# Altium project HDMI_to_RGB.PrjPcb
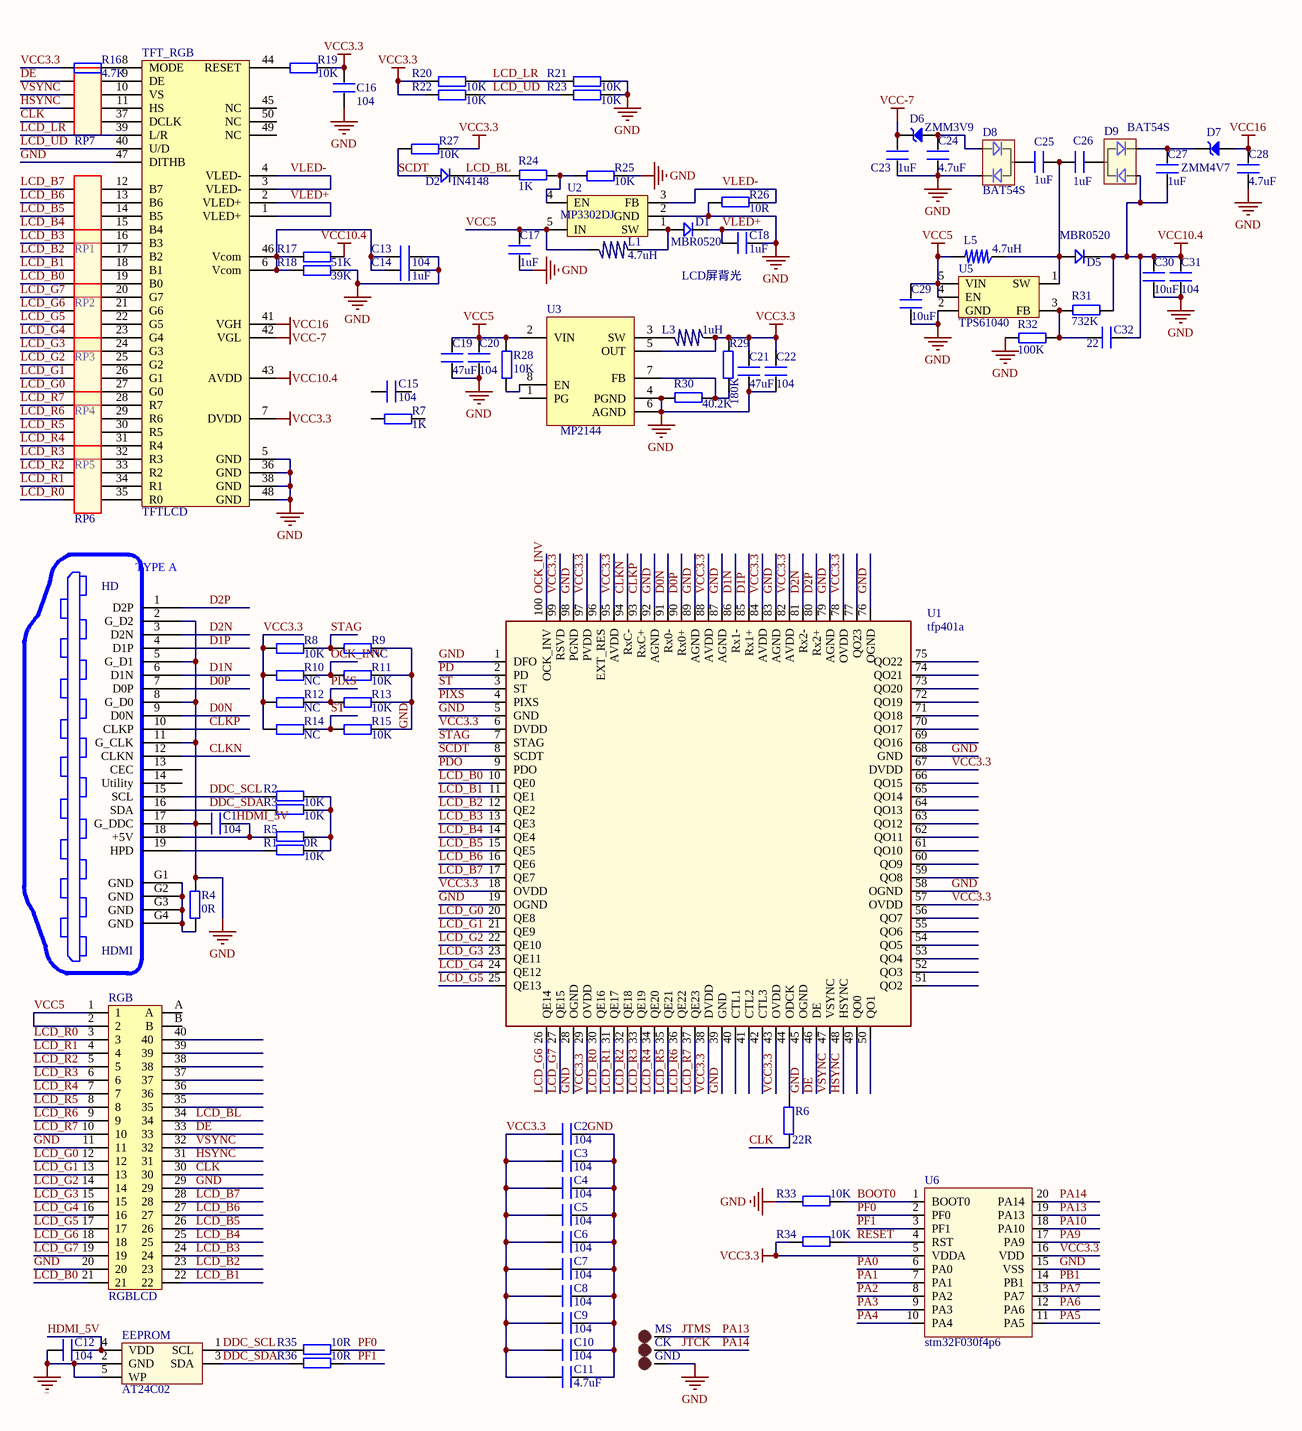
[diagram p0: HDMI_to_RGB.SchDoc]
1 sheet, 97 parts. Net scope: global (net labels, ports and power ports of the same name join across sheets).
Board file: HDMI_to_RGB.PcbDoc

## Sheet HDMI_to_RGB.SchDoc
size A3

### Parts
C1  104  [C 0603_L]
C2  104  [C 0603_L]
C3  104  [C 0603_L]
C4  104  [C 0603_L]
C5  104  [C 0603_L]
C6  104  [C 0603_L]
C7  104  [C 0603_L]
C8  104  [C 0603_L]
C9  104  [C 0603_L]
C10  104  [C 0603_L]
C11  4.7uF  [C 0603_L]
C12  104  [C 0603_L]
C13  104  [C 0603_L]
C14  1uF  [C 0603_L]
C15  104  [C 0603_L]
C16  104  [C 0603_L]
C17  1uF  [C 0603_L]
C18  1uF  [C 0603_L]
C19  47uF  [C 0805_L]
C20  104  [C 0603_L]
C21  47uF  [C 0805_L]
C22  104  [C 0603_L]
C23  1uF  [C 0603_L]
C24  4.7uF  [C 0603_L]
C25  1uF  [C 0603_L]
C26  1uF  [C 0603_L]
C27  1uF  [C 0603_L]
C28  4.7uF  [C 0603_L]
C29  10uF  [C 0603_L]
C30  10uF  [C 0603_L]
C31  104  [C 0603_L]
C32  22  [C 0603_L]
CK  TEST POINT  [TP-1.5]  (value not drawn)
D1  MBR0520  [SOD-123]
D2  IN4148  [SOD-123]
D5  MBR0520  [SOD-123]
D6  ZMM3V9  [DIODE_ZMMx]
D7  ZMM4V7  [DIODE_ZMMx]
D8  BAT54S  [SOT-23]
D9  BAT54S  [SOT-23]
EEPROM  AT24C02  [AT24C02]
GND  TEST POINT  [TP-1.5]  (value not drawn)
HD  HDMI  [HDMI_A]
L1  4.7uH  [NR4010]
L3  1uH  [NR3015]
L5  4.7uH  [NR4010]
MS  TEST POINT  [TP-1.5]  (value not drawn)
R1  10K  [R 0603_L]
R2  10K  [R 0603_L]
R3  10K  [R 0603_L]
R4  0R  [R 0603_L]
R5  0R  [R 0603_L]
R6  22R  [R 0603_L]
R7  1K  [R 0603_L]
R8  10K  [R 0603_L]
R9  NC  [R 0603_L]
R10  NC  [R 0603_L]
R11  10K  [R 0603_L]
R12  NC  [R 0603_L]
R13  10K  [R 0603_L]
R14  NC  [R 0603_L]
R15  10K  [R 0603_L]
R16  4.7K  [R 0603_L]
R17  51K  [R 0603_L]
R18  39K  [R 0603_L]
R19  10K  [R 0603_L]
R20  10K  [R 0603_L]
R21  10K  [R 0603_L]
R22  10K  [R 0603_L]
R23  10K  [R 0603_L]
R24  1K  [R 0603_L]
R25  10K  [R 0603_L]
R26  10R  [R 0603_L]
R27  10K  [R 0603_L]
R28  10K  [R 0603_L]
R29  180K  [R 0603_L]
R30  40.2K  [R 0603_L]
R31  732K  [R 0603_L]
R32  100K  [R 0603_L]
R33  10K  [R 0603_L]
R34  10K  [R 0603_L]
R35  10R  [R 0603_L]
R36  10R  [R 0603_L]
RGB  RGBLCD  [FPC0.5 2H-WS-40P]
RP1  33R  [P_pack]  (value not drawn)
RP2  33R  [P_pack]  (value not drawn)
RP3  33R  [P_pack]  (value not drawn)
RP4  33R  [P_pack]  (value not drawn)
RP5  33R  [P_pack]  (value not drawn)
RP6  33R  [P_pack]  (value not drawn)
RP7  33R  [P_pack]  (value not drawn)
TFT_RGB  TFTLCD  [FPC-TOP50]
U1  tfp401a  [LQFP100]
U2  MP3302DJ  [SOT23-5L]
U3  MP2144  [SOT23-8L]
U5  TPS61040  [SOT23-5L]
U6  stm32F030f4p6  [TSSOP20_N]

### Nets
GND: C1.2 C2.1 C3.1 C4.1 C5.1 C6.1 C7.1 C8.1 C9.1 C10.1 C11.1 C12.1 C13.2 C14.2 C16.1 C17.1 C18.1 C19.1 C20.1 C21.1 C22.1 C23.2 C24.2 C28.1 C29.1 C30.1 C31.2 D8.2 EEPROM.2(GND) EEPROM.5(WP) GND.1 HD.2(G_D2) HD.5(G_D1) HD.8(G_D0) HD.11(G_CLK) HD.17(G_DDC) R4.1 R9.2 R11.2 R13.2 R15.2 R18.2 R21.2 R23.2 R25.2 R26.2 R30.2 R32.1 R33.2 RGB.11 RGB.20 RGB.29 TFT_RGB.5(GND) TFT_RGB.36(GND) TFT_RGB.38(GND) TFT_RGB.47(DITHB) TFT_RGB.48(GND) U1.1(DFO) U1.5(GND) U1.19(OGND) U1.28(OGND) U1.39(GND) U1.45(OGND) U1.58(OGND) U1.68(GND) U1.76(OGND) U1.79(AGND) U1.83(AGND) U1.87(AGND) U1.89(AGND) U1.92(AGND) U1.98(PGND) U2.2(GND) U3.4(PGND) U3.6(AGND) U5.2(GND) U6.15(VSS)
VCC3.3: C2.2 C3.2 C4.2 C5.2 C6.2 C7.2 C8.2 C9.2 C10.2 C11.2 C16.2 C21.2 C22.2 L3.1 R8.1 R10.1 R12.1 R14.1 R16.1 R19.2 R20.1 R22.1 R27.2 R29.1 R34.2 TFT_RGB.7(DVDD) U1.6(DVDD) U1.18(OVDD) U1.29(OVDD) U1.38(DVDD) U1.43(OVDD) U1.57(OVDD) U1.67(DVDD) U1.78(OVDD) U1.82(AVDD) U1.84(AVDD) U1.88(AVDD) U1.95(AVDD) U1.97(PVDD) U1.99(RSVD) U3.5(OUT) U6.5(VDDA) U6.16(VDD)
VCC5: C17.2 C19.2 C20.2 C29.2 L1.1 L5.2 R28.2 RGB.1 RGB.2 U2.5(IN) U3.2(VIN) U5.4(EN) U5.5(VIN)
VCC10.4: C27.1 C30.2 C31.1 C32.1 D5.2 D9.1 R17.2 R31.1 TFT_RGB.43(AVDD)
VCC16: C28.2 D7.1 TFT_RGB.41(VGH)
VCC-7: C23.1 D6.2 TFT_RGB.42(VGL)
BOOT0: R33.1 U6.1(BOOT0)
CLK: R6.2 RGB.30 RP7.7
CLKN: HD.12(CLKN) U1.94(RxC-)
CLKP: HD.10(CLKP) U1.93(RxC+)
D0N: HD.9(D0N) U1.91(Rx0-)
D0P: HD.7(D0P) U1.90(Rx0+)
D1N: HD.6(D1N) U1.86(Rx1-)
D1P: HD.4(D1P) U1.85(Rx1+)
D2N: HD.3(D2N) U1.81(Rx2-)
D2P: HD.1(D2P) U1.80(Rx2+)
DDC_SCL: EEPROM.1(SCL) HD.15(SCL) R2.2 R35.2
DDC_SDA: EEPROM.3(SDA) HD.16(SDA) R3.2 R36.2
DE: RGB.33 RP7.1 U1.46(DE)
HDMI_5V: C1.1 C12.2 EEPROM.4(VDD) HD.18(+5V) R5.2
HSYNC: RGB.31 RP7.5 U1.48(HSYNC)
JTCK: CK.1 U6.20(PA14)  [also labelled PA14]
JTMS: MS.1 U6.19(PA13)  [also labelled PA13]
LCD_B0: RGB.21 RP2.7 U1.10(QE0)
LCD_B1: RGB.22 RP2.5 U1.11(QE1)
LCD_B2: RGB.23 RP2.3 U1.12(QE2)
LCD_B3: RGB.24 RP2.1 U1.13(QE3)
LCD_B4: RGB.25 RP1.7 U1.14(QE4)
LCD_B5: RGB.26 RP1.5 U1.15(QE5)
LCD_B6: RGB.27 RP1.3 U1.16(QE6)
LCD_B7: RGB.28 RP1.1 U1.17(QE7)
LCD_BL: D2.2 R24.2 RGB.34
LCD_G0: RGB.12 RP4.7 U1.20(QE8)
LCD_G1: RGB.13 RP4.5 U1.21(QE9)
LCD_G2: RGB.14 RP4.3 U1.22(QE10)
LCD_G3: RGB.15 RP4.1 U1.23(QE11)
LCD_G4: RGB.16 RP3.7 U1.24(QE12)
LCD_G5: RGB.17 RP3.5 U1.25(QE13)
LCD_G6: RGB.18 RP3.3 U1.26(QE14)
LCD_G7: RGB.19 RP3.1 U1.27(QE15)
LCD_LR: R20.2 R21.1 TFT_RGB.39(L/R)
LCD_R0: RGB.3 RP6.7 U1.30(QE16)
LCD_R1: RGB.4 RP6.5 U1.31(QE17)
LCD_R2: RGB.5 RP6.3 U1.32(QE18)
LCD_R3: RGB.6 RP6.1 U1.33(QE19)
LCD_R4: RGB.7 RP5.7 U1.34(QE20)
LCD_R5: RGB.8 RP5.5 U1.35(QE21)
LCD_R6: RGB.9 RP5.3 U1.36(QE22)
LCD_R7: RGB.10 RP5.1 U1.37(QE23)
LCD_UD: R22.2 R23.1 TFT_RGB.40(U/D)
OCK_INV: R10.2 R11.1 U1.100(OCK_INV)
PA0: U6.6(PA0)
PA1: U6.7(PA1)
PA2: U6.8(PA2)
PA3: U6.9(PA3)
PA4: U6.10(PA4)
PA5: U6.11(PA5)
PA6: U6.12(PA6)
PA7: U6.13(PA7)
PA9: U6.17(PA9)
PA10: U6.18(PA10)
PB1: U6.14(PB1)
PD: U1.2(PD)
PDO: U1.9(PDO)
PF0: R35.1 U6.2(PF0)
PF1: R36.1 U6.3(PF1)
PIXS: R12.2 R13.1 U1.4(PIXS)
RESET: R34.1 U6.4(RST)
SCDT: D2.1 R27.1 U1.8(SCDT)
ST: R14.2 R15.1 U1.3(ST)
STAG: R8.2 R9.1 U1.7(STAG)
VLED+: C18.2 D1.2 TFT_RGB.1(VLED+) TFT_RGB.2(VLED+)
VLED-: R26.1 TFT_RGB.3(VLED-) TFT_RGB.4(VLED-) U2.3(FB)
VSYNC: RGB.32 RP7.3 U1.47(VSYNC)
NetC13_1: C13.1 C14.1 R17.1 R18.1 TFT_RGB.6(Vcom) TFT_RGB.46(Vcom)
NetC24_1: C24.1 D6.1 D8.1
NetC25_1: C25.1 D8.3
NetC25_2: C25.2 C26.1 D5.1 L5.1 U5.1(SW)
NetC26_2: C26.2 D9.3
NetC27_2: C27.2 D7.2 D9.2
NetC32_2: C32.2 R31.2 R32.2 U5.3(FB)
NetD1_1: D1.1 L1.2 U2.1(SW)
NetHD_19: HD.19(HPD) R1.2
NetHD_G1: HD.G1(GND) HD.G2(GND) HD.G3(GND) HD.G4(GND) R4.2
NetL3_2: L3.2 U3.3(SW)
NetR1_1: R1.1 R2.1 R3.1 R5.1
NetR6_1: R6.1 U1.44(ODCK)
NetR16_2: R16.2 TFT_RGB.8(MODE)
NetR19_1: R19.1 TFT_RGB.44(RESET)
NetR24_1: R24.1 R25.1 U2.4(EN)
NetR28_1: R28.1 U3.8(EN)
NetR29_2: R29.2 R30.1 U3.7(FB)
NetRP1_2: RP1.2 TFT_RGB.12(B7)
NetRP1_4: RP1.4 TFT_RGB.13(B6)
NetRP1_6: RP1.6 TFT_RGB.14(B5)
NetRP1_8: RP1.8 TFT_RGB.15(B4)
NetRP2_2: RP2.2 TFT_RGB.16(B3)
NetRP2_4: RP2.4 TFT_RGB.17(B2)
NetRP2_6: RP2.6 TFT_RGB.18(B1)
NetRP2_8: RP2.8 TFT_RGB.19(B0)
NetRP3_2: RP3.2 TFT_RGB.20(G7)
NetRP3_4: RP3.4 TFT_RGB.21(G6)
NetRP3_6: RP3.6 TFT_RGB.22(G5)
NetRP3_8: RP3.8 TFT_RGB.23(G4)
NetRP4_2: RP4.2 TFT_RGB.24(G3)
NetRP4_4: RP4.4 TFT_RGB.25(G2)
NetRP4_6: RP4.6 TFT_RGB.26(G1)
NetRP4_8: RP4.8 TFT_RGB.27(G0)
NetRP5_2: RP5.2 TFT_RGB.28(R7)
NetRP5_4: RP5.4 TFT_RGB.29(R6)
NetRP5_6: RP5.6 TFT_RGB.30(R5)
NetRP5_8: RP5.8 TFT_RGB.31(R4)
NetRP6_2: RP6.2 TFT_RGB.32(R3)
NetRP6_4: RP6.4 TFT_RGB.33(R2)
NetRP6_6: RP6.6 TFT_RGB.34(R1)
NetRP6_8: RP6.8 TFT_RGB.35(R0)
NetRP7_2: RP7.2 TFT_RGB.9(DE)
NetRP7_4: RP7.4 TFT_RGB.10(VS)
NetRP7_6: RP7.6 TFT_RGB.11(HS)
NetRP7_8: RP7.8 TFT_RGB.37(DCLK)

Not connected (* = marked no-connect by the designer): C15 1 2; HD 13(CEC) 14(Utility); R7 1 2; RGB 35 36 37 38 39 40 A B; TFT_RGB 45(NC) 49(NC) 50(NC); U1 40(CTL1) 41(CTL2) 42(CTL3) 49(QO0) 50(QO1) 51(QO2) 52(QO3) 53(QO4) 54(QO5) 55(QO6) 56(QO7) 59(QO8) 60(QO9) 61(QO10) 62(QO11) 63(QO12) 64(QO13) 65(QO14) 66(QO15) 69(QO16) 70(QO17) 71(QO18) 72(QO19) 73(QO20) 74(QO21) 75(QO22) 77(QO23) 96(EXT_RES); U3 1(PG)

### Notes on the sheet
- LCD屏背光
- (in symbol HDMI) TYPE A

### Library data of the parts
C1-C32 = C
CK GND MS = TEST-POINT: 测试点
D1 D2 D5 = D: 1N4148
D6 D7 = ZMM3V6
D8 D9 = BAT54S: 双肖特基二极管
L1 L3 = L
L5 = L_SOP
R1-R36 = R
RGB = FPC-40: FPC-40P-0.5mm
RP1-RP7 = R_pack
TFT_RGB = AT070TN92: 7' TFTLCD
U2 = MP3302: LCD背光IC
U5 = TPS61040: DC DC Step Up IC
U6 = stm32f030